# Altium schematic sheet display.SchDoc
size A4
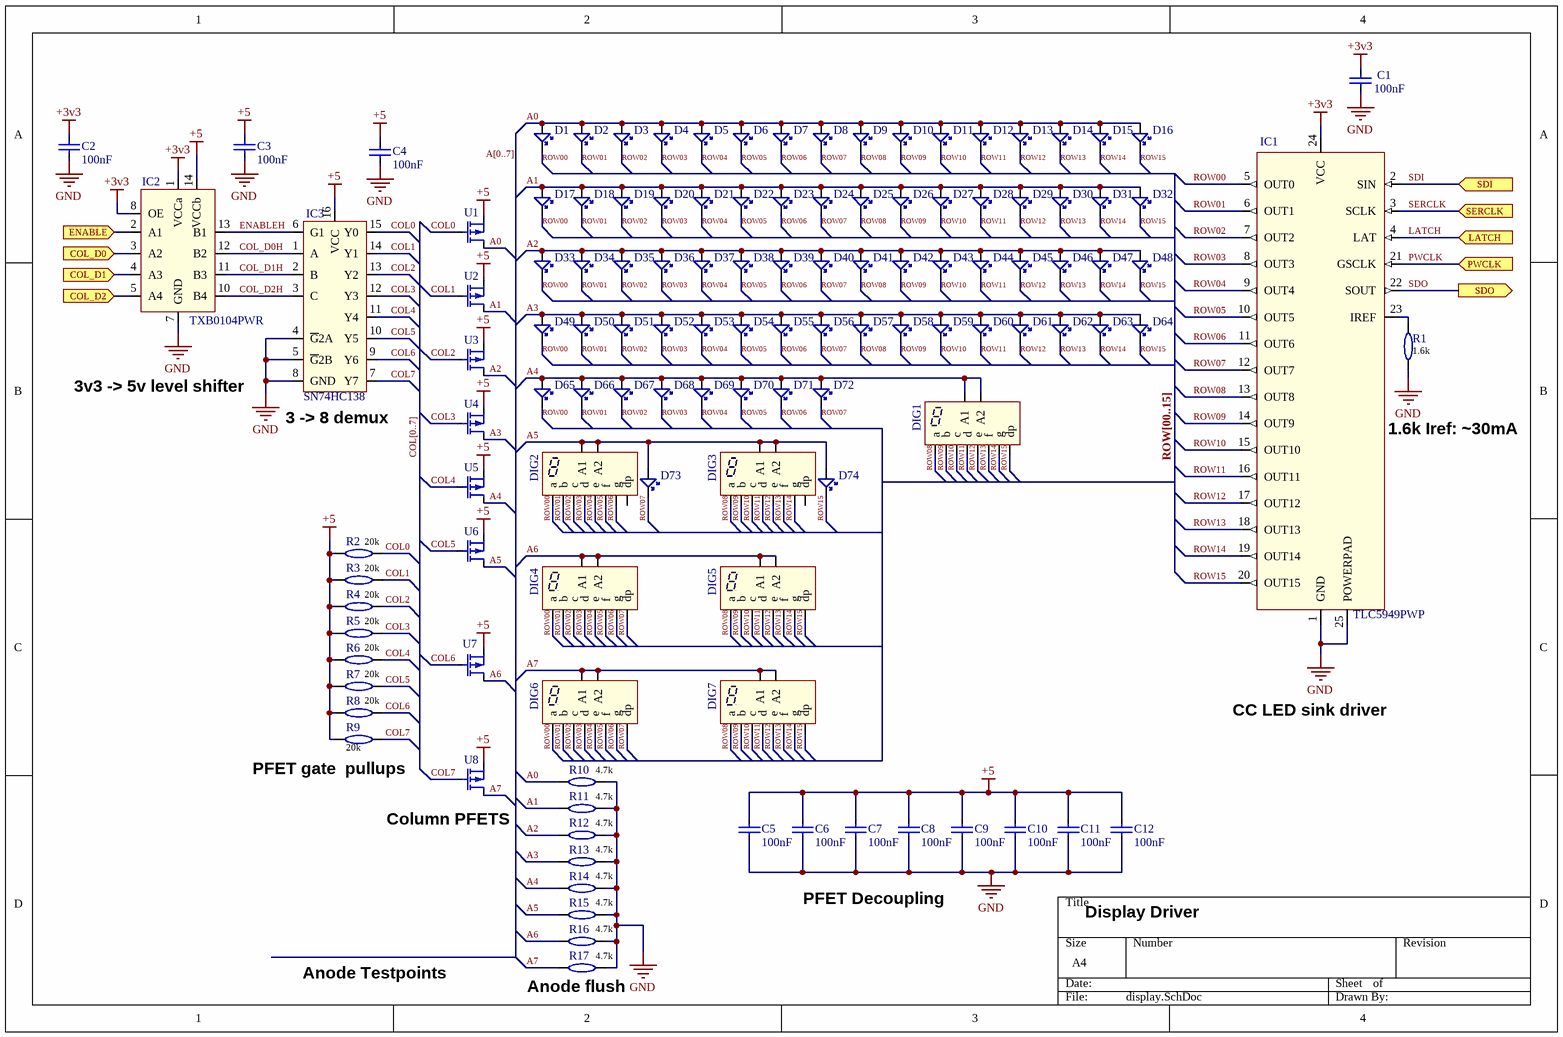
[diagram p0: display.SchDoc]

## Parts
C1  value 100nF  [CAPC_0603_1608X08L]  (hidden comment: Cap)
C2  value 100nF  [CAPC_0603_1608X08L]  (hidden comment: Cap)
C3  value 100nF  [CAPC_0603_1608X08L]  (hidden comment: Cap)
C4  value 100nF  [CAPC_0603_1608X08L]  (hidden comment: Cap)
C5  value 100nF  [CAPC_0603_1608X08L]  (hidden comment: Cap)
C6  value 100nF  [CAPC_0603_1608X08L]  (hidden comment: Cap)
C7  value 100nF  [CAPC_0603_1608X08L]  (hidden comment: Cap)
C8  value 100nF  [CAPC_0603_1608X08L]  (hidden comment: Cap)
C9  value 100nF  [CAPC_0603_1608X08L]  (hidden comment: Cap)
C10  value 100nF  [CAPC_0603_1608X08L]  (hidden comment: Cap)
C11  value 100nF  [CAPC_0603_1608X08L]  (hidden comment: Cap)
C12  value 100nF  [CAPC_0603_1608X08L]  (hidden comment: Cap)
D1  LED  [0603 Chip SMD LED]  (value not drawn)
D2  LED  [0603 Chip SMD LED]  (value not drawn)
D3  LED  [0603 Chip SMD LED]  (value not drawn)
D4  LED  [0603 Chip SMD LED]  (value not drawn)
D5  LED  [0603 Chip SMD LED]  (value not drawn)
D6  LED  [0603 Chip SMD LED]  (value not drawn)
D7  LED  [0603 Chip SMD LED]  (value not drawn)
D8  LED  [0603 Chip SMD LED]  (value not drawn)
D9  LED  [0603 Chip SMD LED]  (value not drawn)
D10  LED  [0603 Chip SMD LED]  (value not drawn)
D11  LED  [0603 Chip SMD LED]  (value not drawn)
D12  LED  [0603 Chip SMD LED]  (value not drawn)
D13  LED  [0603 Chip SMD LED]  (value not drawn)
D14  LED  [0603 Chip SMD LED]  (value not drawn)
D15  LED  [0603 Chip SMD LED]  (value not drawn)
D16  LED  [0603 Chip SMD LED]  (value not drawn)
D17  LED  [0603 Chip SMD LED]  (value not drawn)
D18  LED  [0603 Chip SMD LED]  (value not drawn)
D19  LED  [0603 Chip SMD LED]  (value not drawn)
D20  LED  [0603 Chip SMD LED]  (value not drawn)
D21  LED  [0603 Chip SMD LED]  (value not drawn)
D22  LED  [0603 Chip SMD LED]  (value not drawn)
D23  LED  [0603 Chip SMD LED]  (value not drawn)
D24  LED  [0603 Chip SMD LED]  (value not drawn)
D25  LED  [0603 Chip SMD LED]  (value not drawn)
D26  LED  [0603 Chip SMD LED]  (value not drawn)
D27  LED  [0603 Chip SMD LED]  (value not drawn)
D28  LED  [0603 Chip SMD LED]  (value not drawn)
D29  LED  [0603 Chip SMD LED]  (value not drawn)
D30  LED  [0603 Chip SMD LED]  (value not drawn)
D31  LED  [0603 Chip SMD LED]  (value not drawn)
D32  LED  [0603 Chip SMD LED]  (value not drawn)
D33  LED  [0603 Chip SMD LED]  (value not drawn)
D34  LED  [0603 Chip SMD LED]  (value not drawn)
D35  LED  [0603 Chip SMD LED]  (value not drawn)
D36  LED  [0603 Chip SMD LED]  (value not drawn)
D37  LED  [0603 Chip SMD LED]  (value not drawn)
D38  LED  [0603 Chip SMD LED]  (value not drawn)
D39  LED  [0603 Chip SMD LED]  (value not drawn)
D40  LED  [0603 Chip SMD LED]  (value not drawn)
D41  LED  [0603 Chip SMD LED]  (value not drawn)
D42  LED  [0603 Chip SMD LED]  (value not drawn)
D43  LED  [0603 Chip SMD LED]  (value not drawn)
D44  LED  [0603 Chip SMD LED]  (value not drawn)
D45  LED  [0603 Chip SMD LED]  (value not drawn)
D46  LED  [0603 Chip SMD LED]  (value not drawn)
D47  LED  [0603 Chip SMD LED]  (value not drawn)
D48  LED  [0603 Chip SMD LED]  (value not drawn)
D49  LED  [0603 Chip SMD LED]  (value not drawn)
D50  LED  [0603 Chip SMD LED]  (value not drawn)
D51  LED  [0603 Chip SMD LED]  (value not drawn)
D52  LED  [0603 Chip SMD LED]  (value not drawn)
D53  LED  [0603 Chip SMD LED]  (value not drawn)
D54  LED  [0603 Chip SMD LED]  (value not drawn)
D55  LED  [0603 Chip SMD LED]  (value not drawn)
D56  LED  [0603 Chip SMD LED]  (value not drawn)
D57  LED  [0603 Chip SMD LED]  (value not drawn)
D58  LED  [0603 Chip SMD LED]  (value not drawn)
D59  LED  [0603 Chip SMD LED]  (value not drawn)
D60  LED  [0603 Chip SMD LED]  (value not drawn)
D61  LED  [0603 Chip SMD LED]  (value not drawn)
D62  LED  [0603 Chip SMD LED]  (value not drawn)
D63  LED  [0603 Chip SMD LED]  (value not drawn)
D64  LED  [0603 Chip SMD LED]  (value not drawn)
D65  LED  [0603 Chip SMD LED]  (value not drawn)
D66  LED  [0603 Chip SMD LED]  (value not drawn)
D67  LED  [0603 Chip SMD LED]  (value not drawn)
D68  LED  [0603 Chip SMD LED]  (value not drawn)
D69  LED  [0603 Chip SMD LED]  (value not drawn)
D70  LED  [0603 Chip SMD LED]  (value not drawn)
D71  LED  [0603 Chip SMD LED]  (value not drawn)
D72  LED  [0603 Chip SMD LED]  (value not drawn)
D73  LED  [0603 Chip SMD LED]  (value not drawn)
D74  LED  [0603 Chip SMD LED]  (value not drawn)
DIG1  KCSA03-105  [KCSA03105]  (value not drawn)
DIG2  KCSA03-105  [KCSA03105]  (value not drawn)
DIG3  KCSA03-105  [KCSA03105]  (value not drawn)
DIG4  KCSA03-105  [KCSA03105]  (value not drawn)
DIG5  KCSA03-105  [KCSA03105]  (value not drawn)
DIG6  KCSA03-105  [KCSA03105]  (value not drawn)
DIG7  KCSA03-105  [KCSA03105]  (value not drawn)
IC1  TLC5949PWP  [TSOP65P640X120-24L - POWERPAD]
IC2  TXB0104PWR  [TSOP65P640X120-14L]
IC3  SN74HC138  [TSOP65P640X110-16L]
R1  value 1.6k  [RESC1608X03L]  (hidden comment: RES0603)
R2  value 20k  [RESC1608X03L]  (hidden comment: RES0603)
R3  value 20k  [RESC1608X03L]  (hidden comment: RES0603)
R4  value 20k  [RESC1608X03L]  (hidden comment: RES0603)
R5  value 20k  [RESC1608X03L]  (hidden comment: RES0603)
R6  value 20k  [RESC1608X03L]  (hidden comment: RES0603)
R7  value 20k  [RESC1608X03L]  (hidden comment: RES0603)
R8  value 20k  [RESC1608X03L]  (hidden comment: RES0603)
R9  value 20k  [RESC1608X03L]  (hidden comment: RES0603)
R10  value 4.7k  [RESC1608X03L]  (hidden comment: RES0603)
R11  value 4.7k  [RESC1608X03L]  (hidden comment: RES0603)
R12  value 4.7k  [RESC1608X03L]  (hidden comment: RES0603)
R13  value 4.7k  [RESC1608X03L]  (hidden comment: RES0603)
R14  value 4.7k  [RESC1608X03L]  (hidden comment: RES0603)
R15  value 4.7k  [RESC1608X03L]  (hidden comment: RES0603)
R16  value 4.7k  [RESC1608X03L]  (hidden comment: RES0603)
R17  value 4.7k  [RESC1608X03L]  (hidden comment: RES0603)
U1  MOSFET-P  [SOT95P230X110-3L]  (value not drawn)
U2  MOSFET-P  [SOT95P230X110-3L]  (value not drawn)
U3  MOSFET-P  [SOT95P230X110-3L]  (value not drawn)
U4  MOSFET-P  [SOT95P230X110-3L]  (value not drawn)
U5  MOSFET-P  [SOT95P230X110-3L]  (value not drawn)
U6  MOSFET-P  [SOT95P230X110-3L]  (value not drawn)
U7  MOSFET-P  [SOT95P230X110-3L]  (value not drawn)
U8  MOSFET-P  [SOT95P230X110-3L]  (value not drawn)

## Ports
COL_D0 (in), COL_D1 (in), COL_D2 (in), ENABLE (in), LATCH (in), PWCLK (in), SDI (in), SDO (out), SERCLK (in)

## Nets
+3v3: C1.2 C2.2 IC1.24(VCC) IC2.1(VCCa) IC2.8(OE)
+5: C3.2 C4.2 C5.2 C6.2 C7.2 C8.2 C9.2 C10.2 C11.2 C12.2 IC2.14(VCCb) IC3.16(VCC) R2.2 R3.2 R4.2 R5.1 R6.2 R7.2 R8.2 R9.2 U1.2(S) U2.2(S) U3.2(S) U4.2(S) U5.2(S) U6.2(S) U7.2(S) U8.2(S)
GND: C1.1 C2.1 C3.1 C4.1 C5.1 C6.1 C7.1 C8.1 C9.1 C10.1 C11.1 C12.1 IC1.1(GND) IC1.25(POWERPAD) IC2.7(GND) IC3.4(~{G}2A) IC3.5(~{G}2B) IC3.8(GND) R1.2 R10.1 R11.1 R12.2 R13.1 R14.1 R15.2 R16.2 R17.2
A0: D1.1(A) D2.1(A) D3.1(A) D4.1(A) D5.1(A) D6.1(A) D7.1(A) D8.1(A) D9.1(A) D10.1(A) D11.1(A) D12.1(A) D13.1(A) D14.1(A) D15.1(A) D16.1(A) R10.2 U1.3(D)
A1: D17.1(A) D18.1(A) D19.1(A) D20.1(A) D21.1(A) D22.1(A) D23.1(A) D24.1(A) D25.1(A) D26.1(A) D27.1(A) D28.1(A) D29.1(A) D30.1(A) D31.1(A) D32.1(A) R11.2 U2.3(D)
A2: D33.1(A) D34.1(A) D35.1(A) D36.1(A) D37.1(A) D38.1(A) D39.1(A) D40.1(A) D41.1(A) D42.1(A) D43.1(A) D44.1(A) D45.1(A) D46.1(A) D47.1(A) D48.1(A) R12.1 U3.3(D)
A3: D49.1(A) D50.1(A) D51.1(A) D52.1(A) D53.1(A) D54.1(A) D55.1(A) D56.1(A) D57.1(A) D58.1(A) D59.1(A) D60.1(A) D61.1(A) D62.1(A) D63.1(A) D64.1(A) R13.2 U4.3(D)
A4: D65.1(A) D66.1(A) D67.1(A) D68.1(A) D69.1(A) D70.1(A) D71.1(A) D72.1(A) DIG1.3(A1) DIG1.8(A2) R14.2 U5.3(D)
A5: D73.1(A) D74.1(A) DIG2.3(A1) DIG2.8(A2) DIG3.3(A1) DIG3.8(A2) R15.1 U6.3(D)
A6: DIG4.3(A1) DIG4.8(A2) DIG5.3(A1) DIG5.8(A2) R16.1 U7.3(D)
A7: DIG6.3(A1) DIG6.8(A2) DIG7.3(A1) DIG7.8(A2) R17.1 U8.3(D)
COL0: IC3.15(Y0) R2.1 U1.1(G)
COL1: IC3.14(Y1) R3.1 U2.1(G)
COL2: IC3.13(Y2) R4.1 U3.1(G)
COL3: IC3.12(Y3) R5.2 U4.1(G)
COL4: IC3.11(Y4) R6.1 U5.1(G)
COL5: IC3.10(Y5) R7.1 U6.1(G)
COL6: IC3.9(Y6) R8.1 U7.1(G)
COL7: IC3.7(Y7) R9.1 U8.1(G)
COL_D0: IC2.3(A2) ; port COL_D0
COL_D0H: IC2.12(B2) IC3.1(A)
COL_D1: IC2.4(A3) ; port COL_D1
COL_D1H: IC2.11(B3) IC3.2(B)
COL_D2: IC2.5(A4) ; port COL_D2
COL_D2H: IC2.10(B4) IC3.3(C)
ENABLE: IC2.2(A1) ; port ENABLE
ENABLEH: IC2.13(B1) IC3.6(G1)
LATCH: IC1.4(LAT) ; port LATCH
PWCLK: IC1.21(GSCLK) ; port PWCLK
ROW00: D1.2(C) D17.2(C) D33.2(C) D49.2(C) D65.2(C) DIG2.7(a) DIG4.7(a) DIG6.7(a) IC1.5(OUT0)
ROW01: D2.2(C) D18.2(C) D34.2(C) D50.2(C) D66.2(C) DIG2.6(b) DIG4.6(b) DIG6.6(b) IC1.6(OUT1)
ROW02: D3.2(C) D19.2(C) D35.2(C) D51.2(C) D67.2(C) DIG2.4(c) DIG4.4(c) DIG6.4(c) IC1.7(OUT2)
ROW03: D4.2(C) D20.2(C) D36.2(C) D52.2(C) D68.2(C) DIG2.2(d) DIG4.2(d) DIG6.2(d) IC1.8(OUT3)
ROW04: D5.2(C) D21.2(C) D37.2(C) D53.2(C) D69.2(C) DIG2.1(e) DIG4.1(e) DIG6.1(e) IC1.9(OUT4)
ROW05: D6.2(C) D22.2(C) D38.2(C) D54.2(C) D70.2(C) DIG2.9(f) DIG4.9(f) DIG6.9(f) IC1.10(OUT5)
ROW06: D7.2(C) D23.2(C) D39.2(C) D55.2(C) D71.2(C) DIG2.10(g) DIG4.10(g) DIG6.10(g) IC1.11(OUT6)
ROW07: D8.2(C) D24.2(C) D40.2(C) D56.2(C) D72.2(C) D73.2(C) DIG4.5(dp) DIG6.5(dp) IC1.12(OUT7)
ROW08: D9.2(C) D25.2(C) D41.2(C) D57.2(C) DIG1.7(a) DIG3.7(a) DIG5.7(a) DIG7.7(a) IC1.13(OUT8)
ROW09: D10.2(C) D26.2(C) D42.2(C) D58.2(C) DIG1.6(b) DIG3.6(b) DIG5.6(b) DIG7.6(b) IC1.14(OUT9)
ROW10: D11.2(C) D27.2(C) D43.2(C) D59.2(C) DIG1.4(c) DIG3.4(c) DIG5.4(c) DIG7.4(c) IC1.15(OUT10)
ROW11: D12.2(C) D28.2(C) D44.2(C) D60.2(C) DIG1.2(d) DIG3.2(d) DIG5.2(d) DIG7.2(d) IC1.16(OUT11)
ROW12: D13.2(C) D29.2(C) D45.2(C) D61.2(C) DIG1.1(e) DIG3.1(e) DIG5.1(e) DIG7.1(e) IC1.17(OUT12)
ROW13: D14.2(C) D30.2(C) D46.2(C) D62.2(C) DIG1.9(f) DIG3.9(f) DIG5.9(f) DIG7.9(f) IC1.18(OUT13)
ROW14: D15.2(C) D31.2(C) D47.2(C) D63.2(C) DIG1.10(g) DIG3.10(g) DIG5.10(g) DIG7.10(g) IC1.19(OUT14)
ROW15: D16.2(C) D32.2(C) D48.2(C) D64.2(C) D74.2(C) DIG1.5(dp) DIG5.5(dp) DIG7.5(dp) IC1.20(OUT15)
SDI: IC1.2(SIN) ; port SDI
SDO: IC1.22(SOUT) ; port SDO
SERCLK: IC1.3(SCLK) ; port SERCLK
NetIC1_23: IC1.23(IREF) R1.1

Not connected (* = marked no-connect by the designer): DIG2 5(dp); DIG3 5(dp); IC2 6(NC) 9(NC)

## Buses and harness runs
bus A[0..7]
bus COL[0..7]
bus ROW[00..15]

## Notes on the sheet
- 3v3 -> 5v level shifter
- (near IC3) 3 -> 8 demux
- (near IC1) 1.6k Iref: ~30mA
- CC LED sink driver
- (near R9) PFET gate  pullups
- (near U8) Column PFETS
- PFET Decoupling
- Display Driver
- Anode Testpoints
- (near R17) Anode flush

## Library data of the parts
C1-C12 = Cap: Capacitor; Published: 8-Jun-2000; LatestRevisionDate: 17-Jul-2002; LatestRevisionNote: Re-released for DXP Platform.; PackageReference: RAD-0.3; Publisher: Altium Limited; PackageDescription: Radial Cap, Thru-Hole; 2 Leads; 0.3 in Pin Spacing
D1-D74 = LED: Red 0603 SMD LED
DIG1-DIG7 = KCSA03-105: Low profile 7 segment digit
IC1 = TLC5949PWP: 16 channel cc sink led driver; ClassName: LED_DRIVER
IC2 = TXB0104PWR: 4 channel level shifter
IC3 = SN74HC138: 3 -> 8 demux
R1-R17 = RES0603: Chip Resistor
U1-U8 = MOSFET-P: P channel mosfet 1.2A